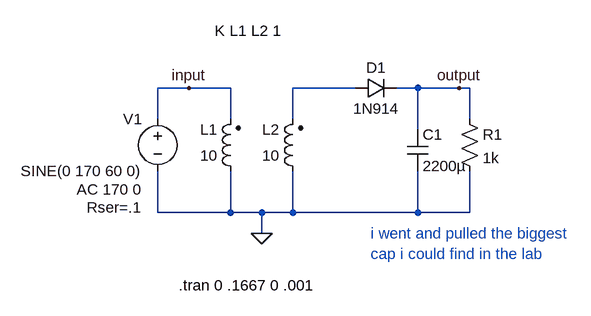
[diagram p0: schematic halfwave_smooth.asc]
halfwave_smooth.asc, the LTspice schematic file:
Version 4
SHEET 1 880 680
WIRE 192 112 144 112
WIRE 256 112 192 112
WIRE 448 112 352 112
WIRE 544 112 512 112
WIRE 608 112 544 112
WIRE 624 112 608 112
WIRE 144 160 144 112
WIRE 256 160 256 112
WIRE 352 160 352 112
WIRE 624 160 624 112
WIRE 544 176 544 112
WIRE 144 304 144 240
WIRE 256 304 256 240
WIRE 256 304 144 304
WIRE 304 304 256 304
WIRE 352 304 352 240
WIRE 352 304 304 304
WIRE 544 304 544 240
WIRE 544 304 352 304
WIRE 624 304 624 240
WIRE 624 304 544 304
WIRE 304 336 304 304
FLAG 304 336 0
FLAG 608 112 output
FLAG 192 112 input
SYMBOL voltage 144 144 M0
WINDOW 123 24 124 Left 2
WINDOW 39 24 152 Left 2
SYMATTR InstName V1
SYMATTR Value SINE(0 170 60 0)
SYMATTR Value2 AC 170 0
SYMATTR SpiceLine Rser=.1
SYMBOL ind2 272 256 R180
WINDOW 0 36 80 Left 2
WINDOW 3 36 40 Left 2
SYMATTR InstName L1
SYMATTR Value 10
SYMATTR Type ind
SYMBOL ind2 368 256 R180
WINDOW 0 36 80 Left 2
WINDOW 3 36 40 Left 2
SYMATTR InstName L2
SYMATTR Value 10
SYMATTR Type ind
SYMBOL diode 448 128 R270
WINDOW 0 32 32 VTop 2
WINDOW 3 0 32 VBottom 2
SYMATTR InstName D1
SYMATTR Value 1N914
SYMBOL res 608 144 R0
SYMATTR InstName R1
SYMATTR Value 1k
SYMBOL cap 528 176 R0
SYMATTR InstName C1
SYMATTR Value 2200µ
TEXT 232 24 Left 2 !K L1 L2 1
TEXT 176 416 Left 2 !.tran 0 .1667 0 .001
TEXT 472 336 Left 2 ;i went and pulled the biggest\ncap i could find in the lab

The netlist it stands for:
* halfwave_smooth.asc
V1 input 0 SINE(0 170 60 0) AC 170 0 Rser=.1
L1 0 input 10
L2 0 N001 10
D1 N001 output 1N914
R1 output 0 1k
C1 output 0 2200µ
.model D D
.lib standard.dio
K L1 L2 1
.tran 0 .1667 0 .001
* i went and pulled the biggest
* cap i could find in the lab
.backanno
.end